# EAGLE design adpd2211_breakout (EAGLE 8.7.0)
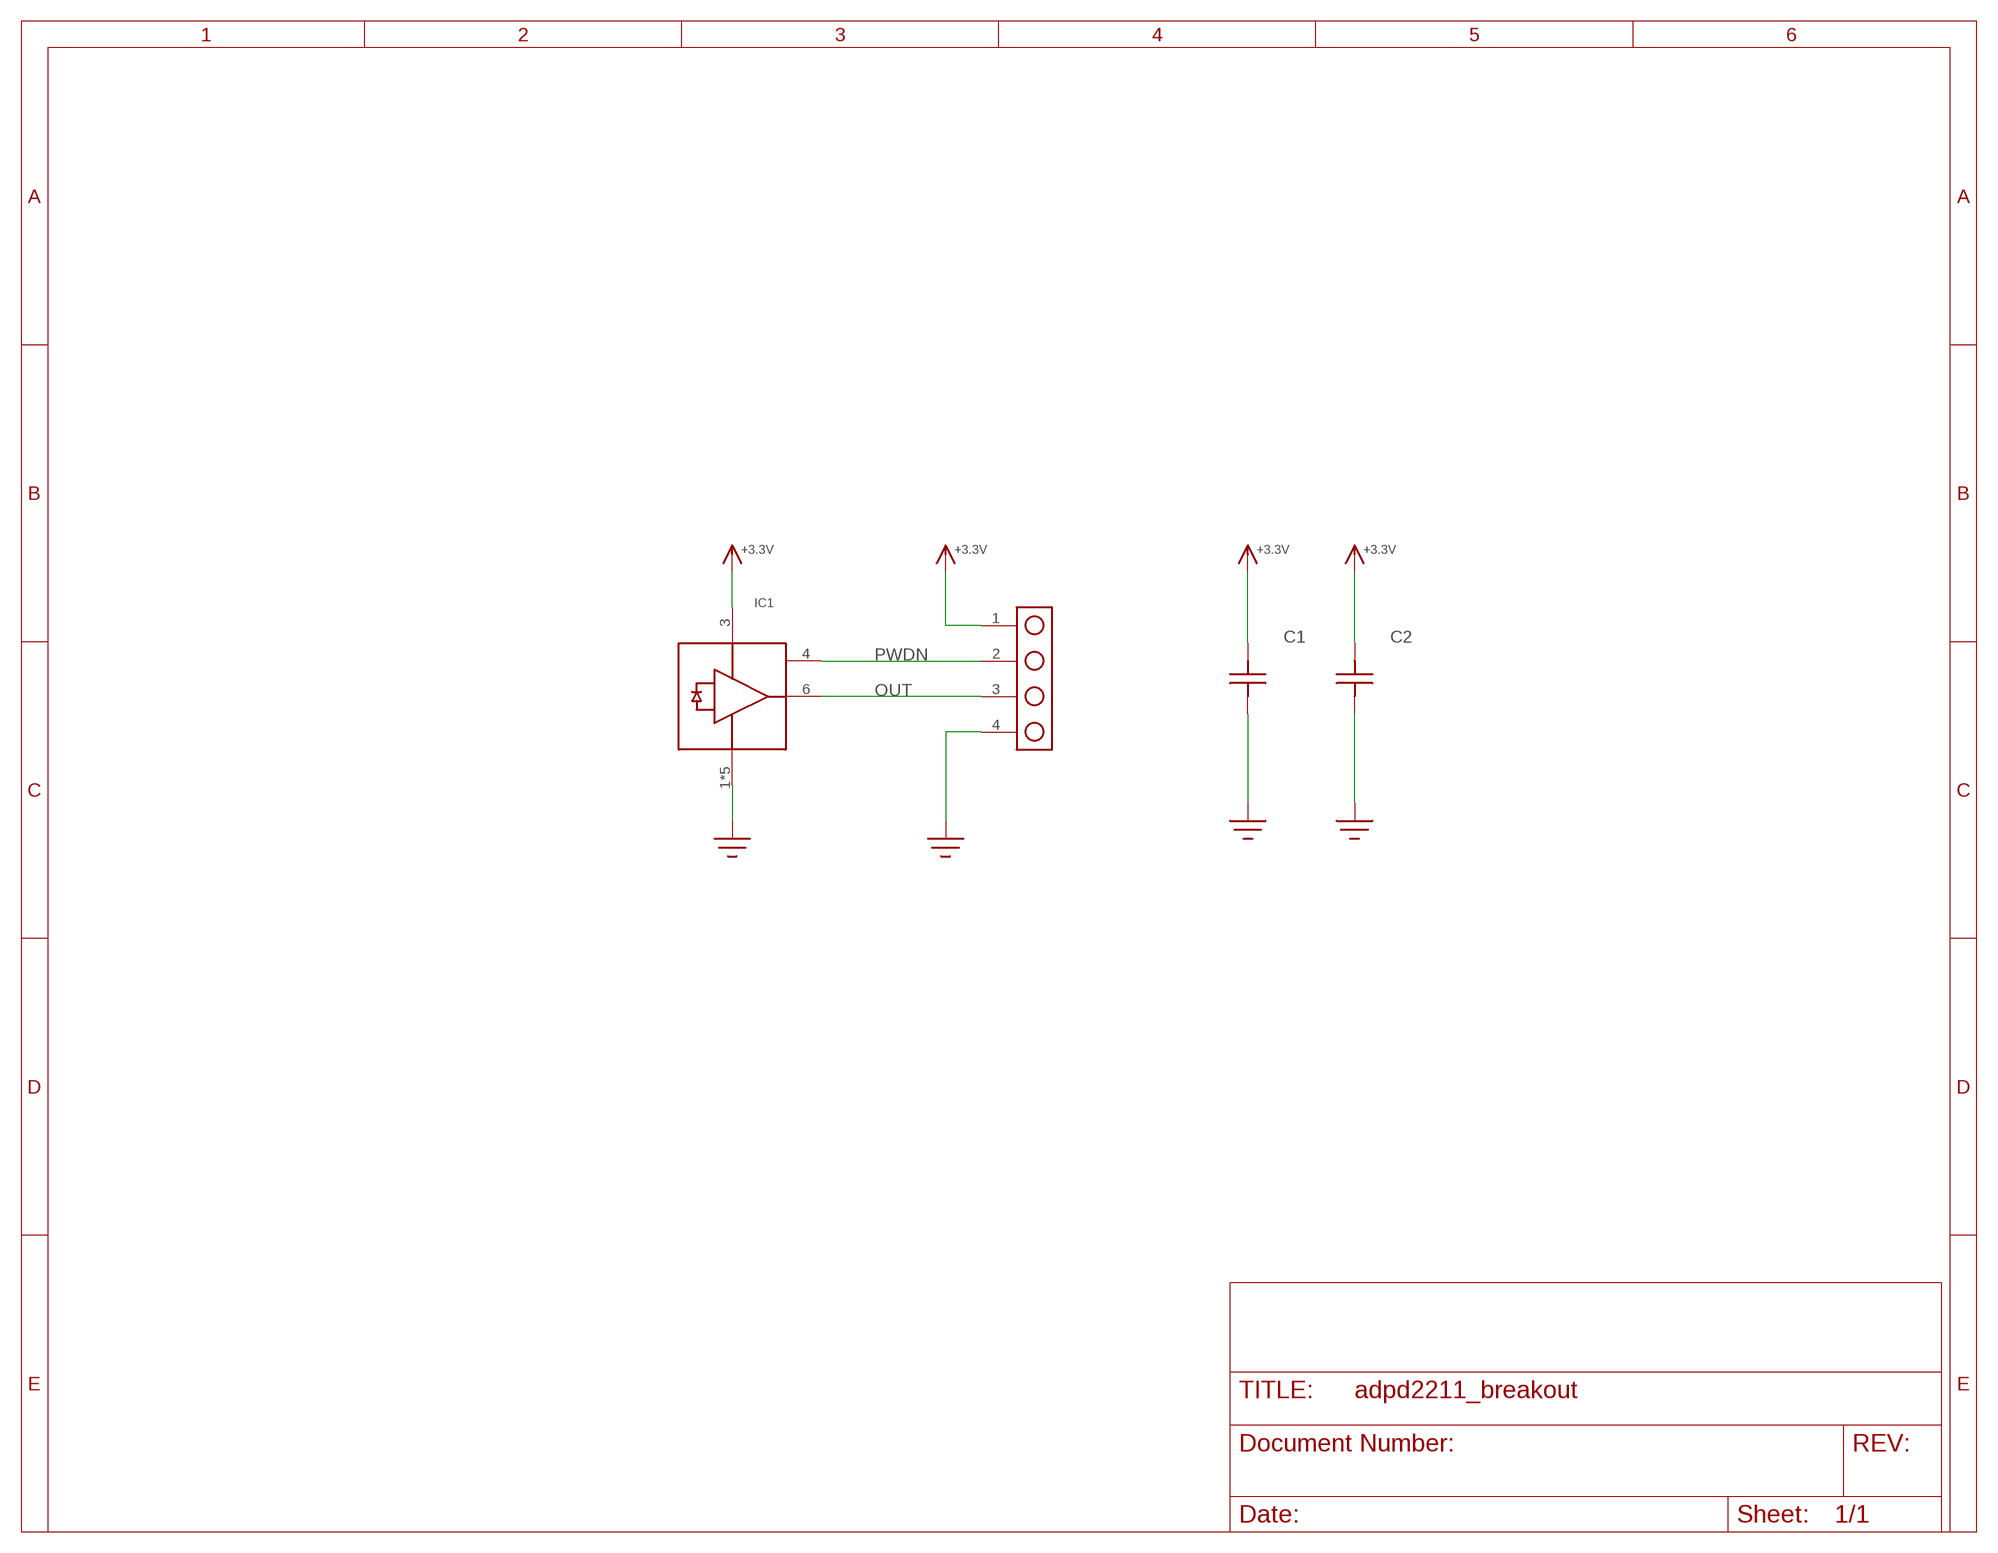
[diagram p0: schematic, sheet 1]

## Parts
C1  C0805  [0805]
C2  C0805  [0805]
IC1  ADPD2211  [LFCSP8]
J1  HEADER_4_PIN  [HEADER_4PIN]

## Nets
+3.3V: C1.P$2 C2.P$2 IC1.3(VCC) J1.1
GND: C1.P$1 C2.P$1 IC1.1(GND) IC1.2(GND) IC1.5(GND) IC1.7(GND) IC1.8(GND) J1.4
OUT: IC1.6(OUT) J1.3
PWDN: IC1.4(PWDN) J1.2

## Library data of the parts
C1 C2 = ssir:C
IC1 = ssir:ADPD2211
J1 = ssir:HEADER_4_PIN

## Board
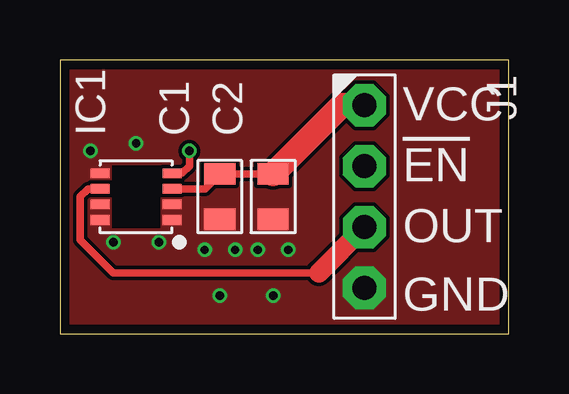
[diagram p1: board, top side]
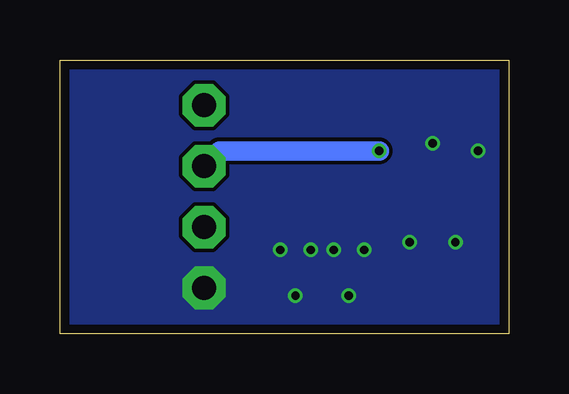
[diagram p2: board, bottom side, seen from below]

Size 18.71 x 11.42 mm. Coordinates in mm from the lower left corner, seen from the top.
Outline: 0,0 18.71,0 18.71,11.42 0,11.42 0,0
Copper layers (1*16): Top 0.035559375mm / dielectric 1.6mm / Bottom 0.035559375mm
Design rules "oshpark-2layer": minimum track width 6mil, minimum drill 10mil, track to track 6mil, track to pad 6mil, pad to pad 6mil, via to via 6mil, smd to smd 6mil, copper to edge 15mil, drill to drill 6mil, minimum pad ring 5mil, minimum via ring 5mil, stop-mask expansion 2.5mil, vias tented up to drill 0mil, thermal gap 10mil

### Footprints (pad centres in the part's own frame; a part is rotated, then mirrored left to right if it is on the bottom)
0805 = smd 0.9 x 1.3: P$1 -0.95,0; P$2 0.95,0
LFCSP8 = smd 0.4 x 0.8: 1 -0.975,-1.5; 2 -0.325,-1.5; 3 0.325,-1.5; 4 0.975,-1.5; 5 0.975,1.5; 6 0.325,1.5; 7 -0.325,1.5; 8 -0.975,1.5
HEADER_4PIN = drill 1 pad 1.778 octagon: 1 -3.81,0; 2 -1.27,0; 3 1.27,0; 4 3.81,0

### Placement (x,y rotation side)
C1  6.67,5.71 90 top
C2  8.89,5.71 90 top
IC1  3.17,5.71 90 top
J1  12.7,5.71 270 top

### Tracks (layer width: path | path; a pad name or v marks a point on that pad's centre or on a via)
+3.3V
  Top 0.305: IC1.3 6.04,6.04 C1.P$2 C2.P$2
  Top 1.016: C2.P$2 11.75,9.53 J1.1
GND  (via drill 0.35)
  other vias: 1.27,7.62 2.22,3.81 4.13,3.81 6.03,3.49 7.3,3.49 8.26,3.49 9.53,3.49 8.89,1.59 6.67,1.59 3.17,7.94
  pour Top (no thermals): 0,0 18.73,0 18.73,11.43 0,11.43
  pour Bottom (no thermals): 0,0 18.73,0 18.73,11.43 0,11.43
OUT
  Top 0.305: IC1.6 1.18,6.04 0.85,5.71 0.85,3.91 2.22,2.54 10.79,2.54
  Top 0.813: 10.79,2.54 J1.3
PWDN  (via drill 0.35)
  Top 0.305: IC1.4 5.1,6.69 5.4,6.99 v5.4,7.62
  Bottom 0.813: v5.4,7.62 12.06,7.62 J1.2

### Text on the board
tPlace: VCC | !EN! | OUT | GND